# Altium schematic sheet EL_SCH.SchDoc
size A4; SheetNumber: 2; SheetTotal: 2; SPICEModelCacheLZFWWSBS: <root> / <DocumentId>LZFWWSBS</DocumentId> / <CacheFrame Number="0"> / <Model Name="cap" Kind="MDL"> / <Text>*Default semiconductor capacitor / .MODEL CAP C()</Text> / </Model> / <Model Name="led1" Kind="MDL"> / <Text>*Typ RED GaAs LED: Vf=1.7V Vr=4V If=40mA trr=3uS / *LED Pinout: 1=A, 2=K / .MODEL LED1 D (IS=93.2P RS=42M N=3.73 BV=4 IBV=10U / + CJO=2.97P VJ=.75 M=.333 TT=4.32U)</Text> / </Model> / </CacheFrame> / </root>
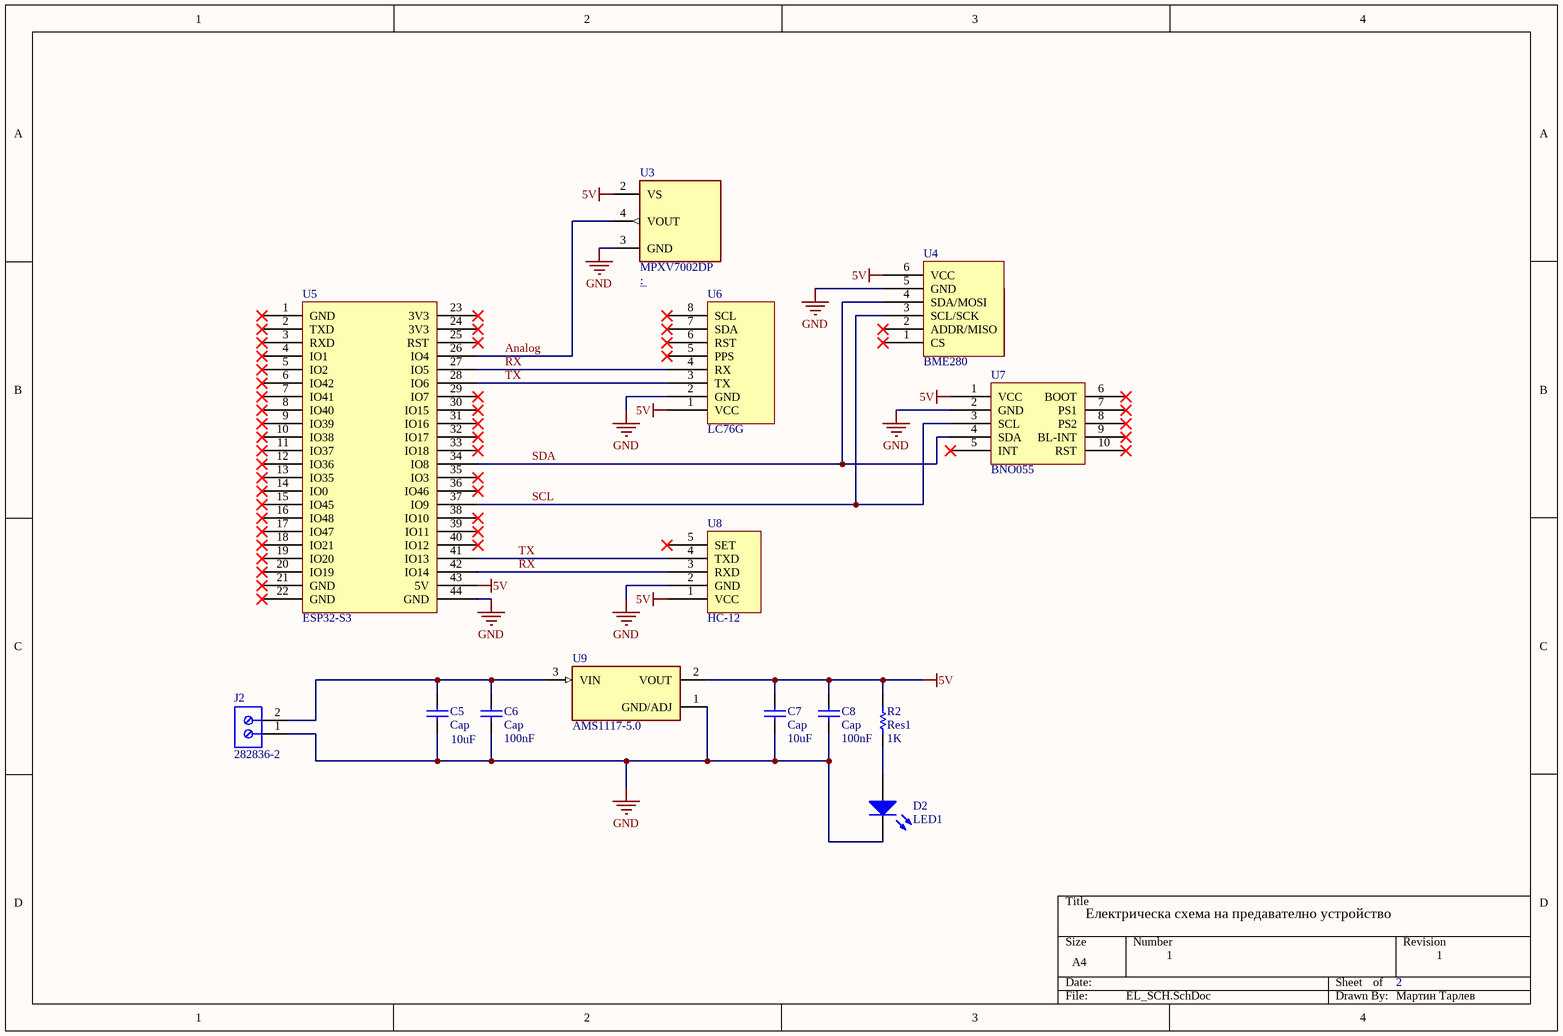
[diagram p0: EL_SCH.SchDoc]

## Parts
C5  Cap  value 10uF  [CAP2]
C6  Cap  value 100nF  [CON]
C7  Cap  value 10uF  [CAP2]
C8  Cap  value 100nF  [CON]
D2  LED1  [LED-1]
J2  282836-2  [TECO-282836-2_V]
R2  Res1  value 1K  [AXIAL-0.3]
U3  MPXV7002DP  [XDCR_MPXV7002DP]
U4  BME280
U5  ESP32-S3
U6  LC76G
U7  BNO055
U8  HC-12
U9  AMS1117-5.0  [SOT229P700X180-4N]

## Nets
5V: C7.2 C8.2 R2.2 U3.2(VS) U4.6(VCC) U5.43(5V) U6.1(VCC) U7.1(VCC) U8.1(VCC) U9.2(VOUT)
GND: C5.1 C6.1 C7.1 C8.1 D2.2(K) J2.1 U3.3(GND) U4.5(GND) U5.44(GND) U6.2(GND) U7.2(GND) U8.2(GND) U9.1(GND/ADJ)
Analog: U3.4(VOUT) U5.26(IO4)
RX: U5.27(IO5) U5.42(IO14) U6.4(RX) U8.3(RXD)
SCL: U4.3(SCL/SCK) U5.37(IO9) U7.3(SCL)
SDA: U4.4(SDA/MOSI) U5.34(IO8) U7.4(SDA)
TX: U5.28(IO6) U5.41(IO13) U6.3(TX) U8.4(TXD)
NetC5_2: C5.2 C6.2 J2.2 U9.3(VIN)
NetD2_1: D2.1(A) R2.1

Not connected (* = marked no-connect by the designer): U4 1(CS)* 2(ADDR/MISO)*; U5 1(GND)* 2(TXD)* 3(RXD)* 4(IO1)* 5(IO2)* 6(IO42)* 7(IO41)* 8(IO40)* 9(IO39)* 10(IO38)* 11(IO37)* 12(IO36)* 13(IO35)* 14(IO0)* 15(IO45)* 16(IO48)* 17(IO47)* 18(IO21)* 19(IO20)* 20(IO19)* 21(GND)* 22(GND)* 23(3V3)* 24(3V3)* 25(RST)* 29(IO7)* 30(IO15)* 31(IO16)* 32(IO17)* 33(IO18)* 35(IO3)* 36(IO46)* 38(IO10)* 39(IO11)* 40(IO12)*; U6 5(PPS)* 6(RST)* 7(SDA)* 8(SCL)*; U7 5(INT)* 6(BOOT)* 7(PS1)* 8(PS2)* 9(BL-INT)* 10(RST)*; U8 5(SET)*

## Notes on the sheet
- Електрическа схема на предавателно устройство
- 1
- 2
- Мартин Тарлев

## Library data of the parts
C5-C8 = Cap: Capacitor; Published: 8-Jun-2000; LatestRevisionDate: 17-Jul-2002; LatestRevisionNote: Re-released for DXP Platform.; PackageReference: RAD-0.3; Publisher: Altium Limited; PackageDescription: Radial Cap, Thru-Hole; 2 Leads; 0.3 in Pin Spacing
D2 = LED1: Typical RED GaAs LED; Published: 8-Jun-2000; LatestRevisionDate: 08-Jul-2005; LatestRevisionNote: Mech Layer 1 removed.; PackageReference: LED-1; Publisher: Altium Limited; PackageDescription: LED; 2 Leads
J2 = CMP-1684-00017-1: Female Header, Pitch 5 mm, 1 x 2 Position, Height 10 mm, Tail Length 3.5 mm, Rohs, Bulk; Manufacturer: TE Connectivity; Wire Gauge: 16-30AWG; Product Training Modules: Wire-to-BoardEurostyleTerminalBlocks; Clamp Material - Plating: Brass-NickelPlated; Voltage: 300V; Mating Orientation: HorizontalwithBoard; Current: 13.5A; Pitch: 0.197"(5.00mm); Screw Thread: M3; 3D Model: 282836-2.pdf; Other Names: 5ULV-02B / A98076; Dynamic Catalog: BuchananSeries; Number of Levels: 1; Torque - Screw: 0.68Nm(6Lb-In); Featured Product: EurostyleTerminalBlockConnectors; Positions Per Level: 2; Wire Termination: Screw-RisingCageClamp; Datasheet URL: http://www.te.com.cn/commerce/DocumentDelivery/DDEController?Action=showdoc&DocId=Catalog+Section%7F1308389_EUROSTYLE_TERMINAL_BLOCKS%7F0607%7Fpdf%7FEnglish%7FENG_CS_1308389_EUROSTYLE_TERMINAL_BLOCKS_0607.pdf%7F282836-2; Color: Green; Family: TerminalBlocks-WiretoBoard; RoHS Information: 282836-2StatementofCompliance; Standard Package: 300; Contact Material - Plating: Brass-TinPlated; Manufacturer URL: http://www.te.com; Housing Material: Polyamide(PA66),Nylon6/6; Features: Interlocking(Side); Package Description: Female Header, Pitch 5 mm, 1 x 2 Position, Height 10 mm, Tail Length 3.5 mm; Mounting Type: ThroughHole; Package Reference: THD; Packaging: Bulk; Series: Buchanan; Category: Connectors,Interconnects; Screw Material - Plating: Brass-NickelPlated
R2 = Res1: Resistor; Published: 8-Jun-2000; LatestRevisionDate: 17-Jul-2002; LatestRevisionNote: Re-released for DXP Platform.; PackageReference: AXIAL-0.3; Publisher: Altium Limited; PackageDescription: Axial Device, Thru-Hole; 2 Leads; 0.3 in Pin Spacing
U3 = MPXV7002DP: Pressure Sensor Â±0.29PSI (Â±2kPa) Differential Male - 0.13 (3.3mm) Tube, Dual 0.5 V ~ 4.5 V 8-BSOP (0.475, 12.06mm Width) Dual Ports, Same Side; MF: NXP USA; Availability: Unavailable; SnapEDA_Link: https://www.snapeda.com/parts/MPXV7002DP/NXP%20USA%20Inc./view-part/490173/?ref=snap; MP: MPXV7002DP; Price: None; Package: - NXP USA; Value: *
U9 = AMS1117-5.0: 1A LOW DROPOUT VOLTAGE REGULATOR; MF: ams; MP: AMS1117-5.0; Package: SOT-223 Seeed Technology; SnapEDA_Link: https://www.snapeda.com/parts/AMS1117-5.0/ams/view-part/?ref=snap; Check_prices: https://www.snapeda.com/parts/AMS1117-5.0/ams/view-part/?ref=eda; Availability: Not in stock; Value: *; Price: None